# EAGLE design circle2 (EAGLE 7.6.0)
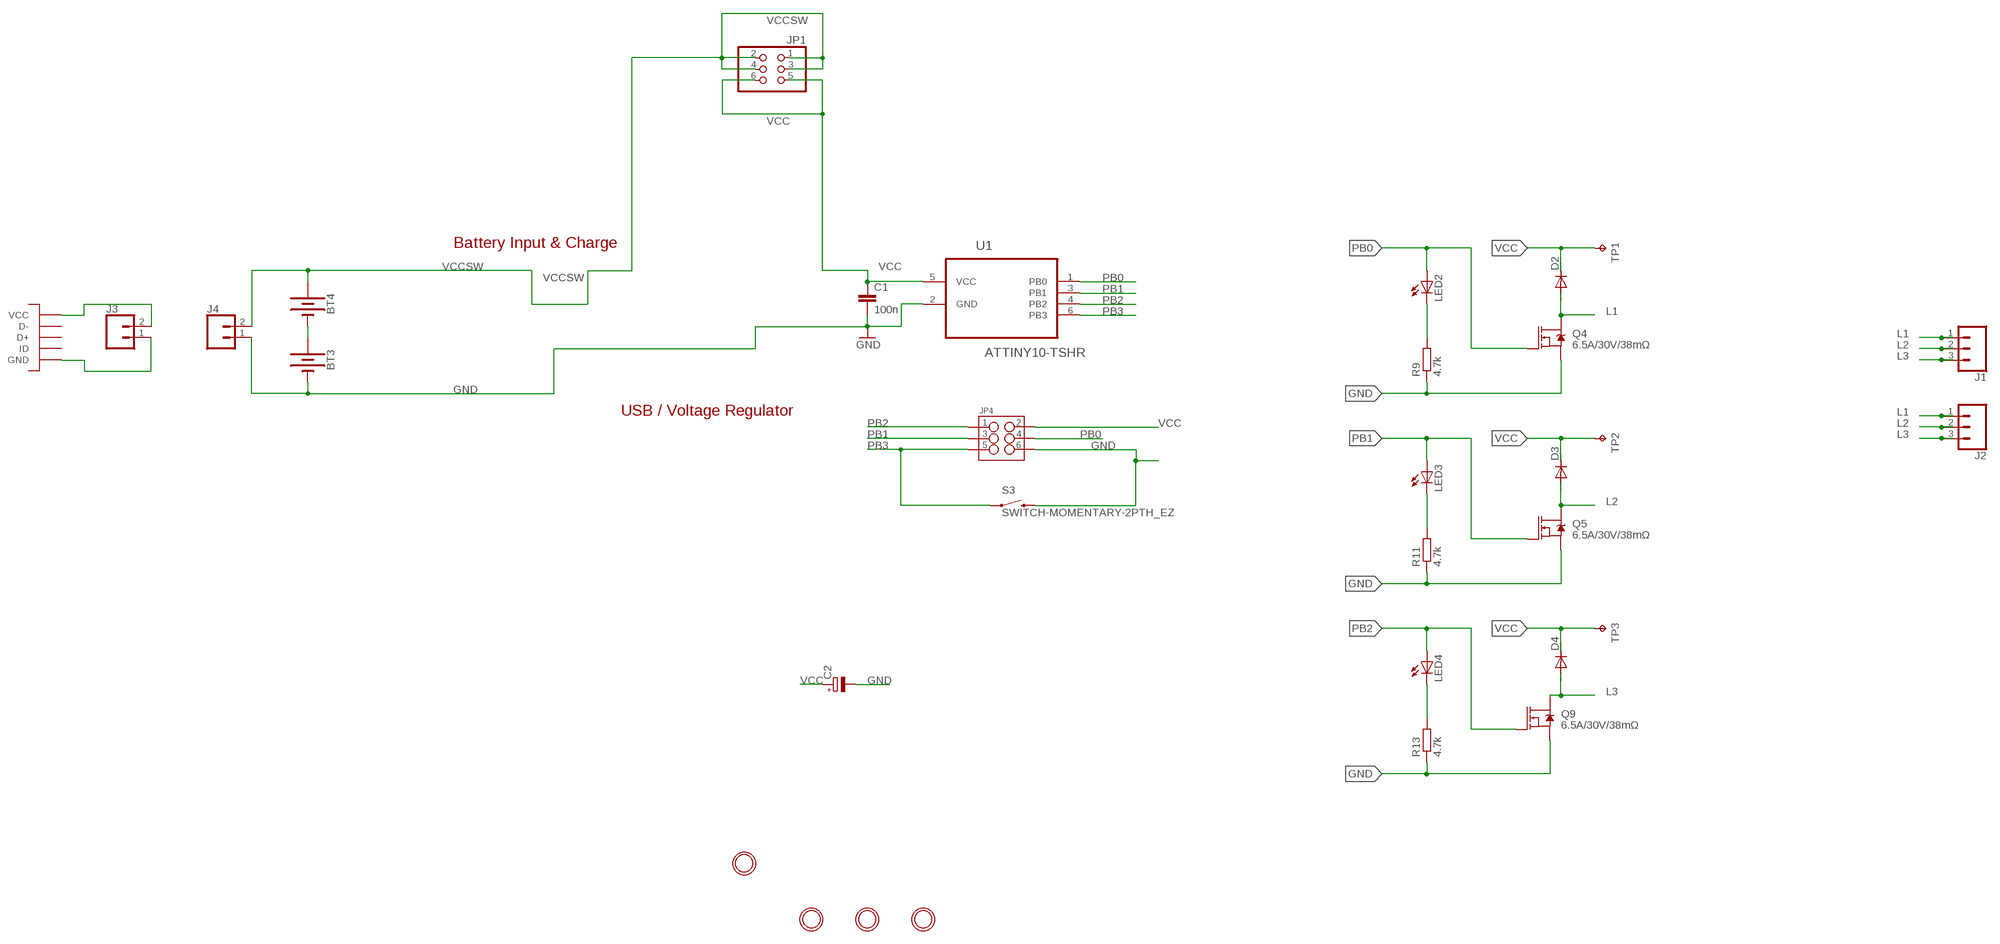
[diagram p0: schematic, sheet 1]

## Parts
BT3  BATTERY-AA_KIT  [BATTERY-AA-KIT]
BT4  BATTERY-AA_KIT  [BATTERY-AA-KIT]
C1  100n  CAP0805  [0805]
C2  CPOL-EUA  [PANASONIC_A]
D2  DIODE-DO214AC  [DO214AC]
D3  DIODE-DO214AC  [DO214AC]
D4  DIODE-DO214AC  [DO214AC]
J1  CONN_031X03_NO_SILK  [1X03_NO_SILK]
J2  CONN_031X03_NO_SILK  [1X03_NO_SILK]
J3  CONN_02LOCK_LONGPADS  [1X02_LOCK_LONGPADS]
J4  CONN_02LOCK_LONGPADS  [1X02_LOCK_LONGPADS]
JP1  PINHD-2X3  [2X03]
JP4  M03X2NO_SILK  [2X3-NS]
LED2  LEDKA-3528ASYC  [KA-3528ASYC]
LED3  LEDKA-3528ASYC  [KA-3528ASYC]
LED4  LEDKA-3528ASYC  [KA-3528ASYC]
Q4  6.5A/30V/38mΩ  MOSFET-NCH-FDS6630A  [SO08]
Q5  6.5A/30V/38mΩ  MOSFET-NCH-FDS6630A  [SO08]
Q9  6.5A/30V/38mΩ  MOSFET-NCH-FDS6630A  [SO08]
R9  4.7k  R-EU_R0603  [R0603]
R11  4.7k  R-EU_R0603  [R0603]
R13  4.7k  R-EU_R0603  [R0603]
S3  SWITCH-MOMENTARY-2PTH_EZ  [TACTILE-PTH-EZ]
TP1  TPTP20SQ  [TP20SQ]
TP2  TPTP20SQ  [TP20SQ]
TP3  TPTP20SQ  [TP20SQ]
U1  ATTINY10-TSHR  [SOT95P280X145-6N]
U$1  MOUNTINGHOLE2.0  [MOUNTINGHOLE_2.0_PLATED]
U$2  MOUNTINGHOLE2.0  [MOUNTINGHOLE_2.0_PLATED]
U$3  MOUNTINGHOLE2.0  [MOUNTINGHOLE_2.0_PLATED]
U$5  MICROUSB  [MICRO_B]
U$7  MOUNTINGHOLE2.0  [MOUNTINGHOLE_2.0_PLATED]

## Nets
GND [vcc]: BT3.GND@1(-) C1.2 C2.- J4.1 JP4.6 Q4.1(S) Q4.2(S) Q4.3(S) Q5.1(S) Q5.2(S) Q5.3(S) Q9.1(S) Q9.2(S) Q9.3(S) R9.1 R11.1 R13.1 S3.3 U1.2(GND)
GND1: J3.1 U$5.GND1(GND) U$5.GND2(GND) U$5.GND3(GND) U$5.GND4(GND) U$5.GND7(GND) U$5.GND8(GND) U$5.P5(GND)
L1: D2.A J1.1 J2.1 Q4.5(D) Q4.6(D) Q4.7(D) Q4.8(D)
L2: D3.A J1.2 J2.2 Q5.5(D) Q5.6(D) Q5.7(D) Q5.8(D)
L3: D4.A J1.3 J2.3 Q9.5(D) Q9.6(D) Q9.7(D) Q9.8(D)
N$1: BT3.PWR@1(+) BT4.GND@1(-)
N$34: LED2.C R9.2
N$36: LED3.C R11.2
N$38: LED4.C R13.2
PB0: JP4.4 LED2.A Q4.4(G) U1.1(PB0)
PB1: JP4.3 LED3.A Q5.4(G) U1.3(PB1)
PB2: JP4.1 LED4.A Q9.4(G) U1.4(PB2)
PB3: JP4.5 S3.1 U1.6(PB3)
VCC [vcc]: C1.1 C2.+ D2.C D3.C D4.C JP1.5 JP1.6 JP4.2 TP1.TP TP2.TP TP3.TP U1.5(VCC)
VCC1: J3.2 U$5.P1(VCC)
VCCSW [vcc]: BT4.PWR@1(+) J4.2 JP1.1 JP1.2 JP1.3 JP1.4
Unconnected: U$5.P2(D-) U$5.P3(D+) U$5.P4(ID)

## Notes on the sheet
- Battery Input & Charge
- USB / Voltage Regulator

## Library data of the parts
BT3 BT4 = SparkFun-Batteries:BATTERY: Battery - Single Cell A variety of battery chemistries, sizes, and footprints. Device List: 20MM_PTH - Coin Cell Battery Holder - 20mm (PTH) <https://www.sparkfun.com/products/783> 12MM_SMD - Coin Cell Battery Holder - 12mm (SMD) <https://www.sparkfun.com/products/10592> 12MM_PTH - Coin Cell Battery Holder - 12mm (PTH) <https://www.sparkfun.com/products/7948> 20MM_SMD - 20mm Coin Cell Battery Holder (SMD) (2 legs) Used on the Big Time Watch Kit <https://www.sparkfun.com/products/11734> 20MM_SMD_4LEGS - Coin Cell Battery Holder - 20mm (SMD) <https://www.sparkfun.com/products/11892> 20MM_SMD_4LEGS_OVERPASTE - Coin Cell Battery Holder - 20mm (SMD) <https://www.sparkfun.com/products/11892> (Over-paste on the legs) 24.5MM_PTH - Coin Cell Battery Holder - 24.5mm (PTH) <https://www.sparkfun.com/products/8863> 9V - 9V Battery Holder - PC Mount Used on the SparkFun SparkPunk Sound Kit <https://www.sparkfun.com/products/11177> and SparkFun SparkPunk Sequencer Kit <https://www.sparkfun.com/products/12707> 18650 - Battery Holder - 18650 (PTH) <https://www.sparkfun.com/products/13113> AA - Battery Holder - 1xAA (PTH) <https://www.sparkfun.com/products/7949> AAA - Battery Holder - 1xAAA (PTH) <https://www.sparkfun.com/products/12718> AA_KIT - Battery Holder - 1xAA (PTH) <https://www.sparkfun.com/products/7949> Special kit package - pads only have exposed copper on one side of the board. AAA_KIT - Battery Holder - 1xAAA (PTH) <https://www.sparkfun.com/products/12718> Special kit package - pads only have exposed copper on one side of the board.; PROD_ID: BATT-08316; SF_SKU: PRT-07949
C1 = SparkFun-Capacitors:CAP: Capacitor Standard 0603 ceramic capacitor, and 0.1" leaded capacitor.
C2 = rcl:CPOL-EU: POLARIZED CAPACITOR, European symbol
D2-D4 = diode:DIODE-: DIODE
J1 J2 = SparkFun-Connectors:CONN_03: Multi connection point. Often used as Generic Header-pin footprint for 0.1 inch spaced/style header connections On any of the 0.1 inch spaced packages, you can populate with these: Break Away Headers - Straight <https://www.sparkfun.com/products/116> (PRT-00116) Break Away Male Headers - Right Angle <https://www.sparkfun.com/products/553> (PRT-00553) Female Headers <https://www.sparkfun.com/products/115> (PRT-00115) Break Away Headers - Machine Pin <https://www.sparkfun.com/products/117> (PRT-00117) Break Away Female Headers - Swiss Machine Pin <https://www.sparkfun.com/products/743> (PRT-00743) Stackable Header - 3 Pin (Female, 0.1") <https://www.sparkfun.com/products/13875> (PRT-13875) For SCREWTERMINALS and SPRING TERMINALS visit here: Screw Terimnals on SparkFun.com <https://www.sparkfun.com/search/results?term=Screw+Terminals> (5mm/3.5mm/2.54mm spacing) This device is also useful as a general connection point to wire up your design to another part of your project. Our various solder wires solder well into these plated through hole pads. Hook-Up Wire - Assortment (Stranded, 22 AWG) <https://www.sparkfun.com/products/11375> (PRT-11375) Hook-Up Wire - Assortment (Solid Core, 22 AWG) <https://www.sparkfun.com/products/11367> (PRT-11367) View the entire wire category on our website here <https://www.sparkfun.com/categories/141> Special notes: Molex polarized connector foot print use with SKU : PRT-08232 with associated crimp pins and housings.
J3 J4 = SparkFun-Connectors:CONN_02: Multi connection point. Often used as Generic Header-pin footprint for 0.1 inch spaced/style header connections On any of the 0.1 inch spaced packages, you can populate with these: Break Away Headers - Straight <https://www.sparkfun.com/products/116> (PRT-00116) Break Away Male Headers - Right Angle <https://www.sparkfun.com/products/553> (PRT-00553) Female Headers <https://www.sparkfun.com/products/115> (PRT-00115) Break Away Headers - Machine Pin <https://www.sparkfun.com/products/117> (PRT-00117) Break Away Female Headers - Swiss Machine Pin <https://www.sparkfun.com/products/743> (PRT-00743) For SCREWTERMINALS and SPRING TERMINALS visit here: Screw Terimnals on SparkFun.com <https://www.sparkfun.com/search/results?term=Screw+Terminals> (5mm/3.5mm/2.54mm spacing) This device is also useful as a general connection point to wire up your design to another part of your project. Our various solder wires solder well into these plated through hole pads. Hook-Up Wire - Assortment (Stranded, 22 AWG) <https://www.sparkfun.com/products/11375> (PRT-11375) Hook-Up Wire - Assortment (Solid Core, 22 AWG) <https://www.sparkfun.com/products/11367> (PRT-11367) View the entire wire category on our website here <https://www.sparkfun.com/categories/141> Special notes: Molex polarized connector foot print use with: PRT-08233 with associated crimp pins and housings. 2.54_SCREWTERM for use with PRT-10571. 3.5mm Screw Terminal footprints for PRT-08084 5mm Screw Terminal footprints for use with PRT-08432
JP1 = pinhead:PINHD-2X3: PIN HEADER
JP4 = SparkFun-Connectors:M03X2: 2x3 .1" header. Shrouded, with keying- CONN-10681 SMT- CONN-11415 Pogo pins- HW-11044
LED2-LED4 = led:LED: LED OSRAM: - CHIPLED LG R971, LG N971, LY N971, LG Q971, LY Q971, LO R971, LY R971 LH N974, LH R974 LS Q976, LO Q976, LY Q976 LO Q996 - Hyper CHIPLED LW Q18S LB Q993, LB Q99A, LB R99A - SideLED LS A670, LO A670, LY A670, LG A670, LP A670 LB A673, LV A673, LT A673, LW A673 LH A674 LY A675 LS A676, LA A676, LO A676, LY A676, LW A676 LS A679, LY A679, LG A679 - Hyper Micro SIDELED® LS Y876, LA Y876, LO Y876, LY Y876 LT Y87S - SmartLED LW L88C, LW L88S LB L89C, LB L89S, LG L890 LS L89K, LO L89K, LY L89K LS L896, LA L896, LO L896, LY L896 - TOPLED LS T670, LO T670, LY T670, LG T670, LP T670 LSG T670, LSP T670, LSY T670, LOP T670, LYG T670 LG T671, LOG T671, LSG T671 LB T673, LV T673, LT T673, LW T673 LH T674 LS T676, LA T676, LO T676, LY T676, LB T676, LH T676, LSB T676, LW T676 LB T67C, LV T67C, LT T67C, LS T67K, LO T67K, LY T67K, LW E67C LS E67B, LA E67B, LO E67B, LY E67B, LB E67C, LV E67C, LT E67C LW T67C LS T679, LY T679, LG T679 LS T770, LO T770, LY T770, LG T770, LP T770 LB T773, LV T773, LT T773, LW T773 LH T774 LS E675, LA E675, LY E675, LS T675 LS T776, LA T776, LO T776, LY T776, LB T776 LHGB T686 LT T68C, LB T68C - Hyper Mini TOPLED® LB M676 - Mini TOPLED Santana® LG M470 LS M47K, LO M47K, LY M47K Source: http://www.osram.convergy.de LUXEON: - LUMILED® LXK2-PW12-R00, LXK2-PW12-S00, LXK2-PW14-U00, LXK2-PW14-V00 LXK2-PM12-R00, LXK2-PM12-S00, LXK2-PM14-U00 LXK2-PE12-Q00, LXK2-PE12-R00, LXK2-PE12-S00, LXK2-PE14-T00, LXK2-PE14-U00 LXK2-PB12-K00, LXK2-PB12-L00, LXK2-PB12-M00, LXK2-PB14-N00, LXK2-PB14-P00, LXK2-PB14-Q00 LXK2-PR12-L00, LXK2-PR12-M00, LXK2-PR14-Q00, LXK2-PR14-R00 LXK2-PD12-Q00, LXK2-PD12-R00, LXK2-PD12-S00 LXK2-PH12-R00, LXK2-PH12-S00 LXK2-PL12-P00, LXK2-PL12-Q00, LXK2-PL12-R00 Source: www.luxeon.com KINGBRIGHT: KA-3528ASYC Source: www.kingbright.com
Q4 Q5 Q9 = SparkFun-DiscreteSemi:MOSFET-NCH: N-channel MOSFETs Voltage controlled devices that allow control of high current outputs. SparkFun Products: SparkFun OpenScale <https://www.sparkfun.com/products/13261> SparkFun Digital Sandbox <https://www.sparkfun.com/products/12651> SparkFun Monster Moto Shield <https://www.sparkfun.com/products/10182> SparkFun MOSFET Power Controller <https://www.sparkfun.com/products/11214>; PROD_ID: TRANS-08089
R9 R11 R13 = rcl:R-EU_: RESISTOR, European symbol
S3 = SparkFun-Electromechanical:SWITCH-MOMENTARY-2: Various NO switches- pushbuttons, reed, etc
TP1-TP3 = testpad:TP: Test pad
U1 = Atmel_By_element14_Batch_1:ATTINY10-TSHR: 8-bit Microcontroller with In-System Programmable Flash; MPN: ATTINY10-TSHR; OC_FARNELL: 1748538; OC_NEWARK: 26R5645; PACKAGE: SOT-23-6; SUPPLIER: Atmel
U$1-U$3 U$7 = microbuilder:MOUNTINGHOLE: Mounting Hole For #2 screws (0.086"/2.18mm width, 0.094"/2.4mm hole) use 2.5mm; BOM: EXCLUDE
U$5 = Other:MICROUSB

## Net classes
0 default: width 0.406 mm, drill 0.381 mm, clearance 0.305 mm
1 vcc: width 0.508 mm, drill 0.381 mm, clearance 0.305 mm
2 gnd: width 0.508 mm, drill 0.381 mm, clearance 0.305 mm

## Board
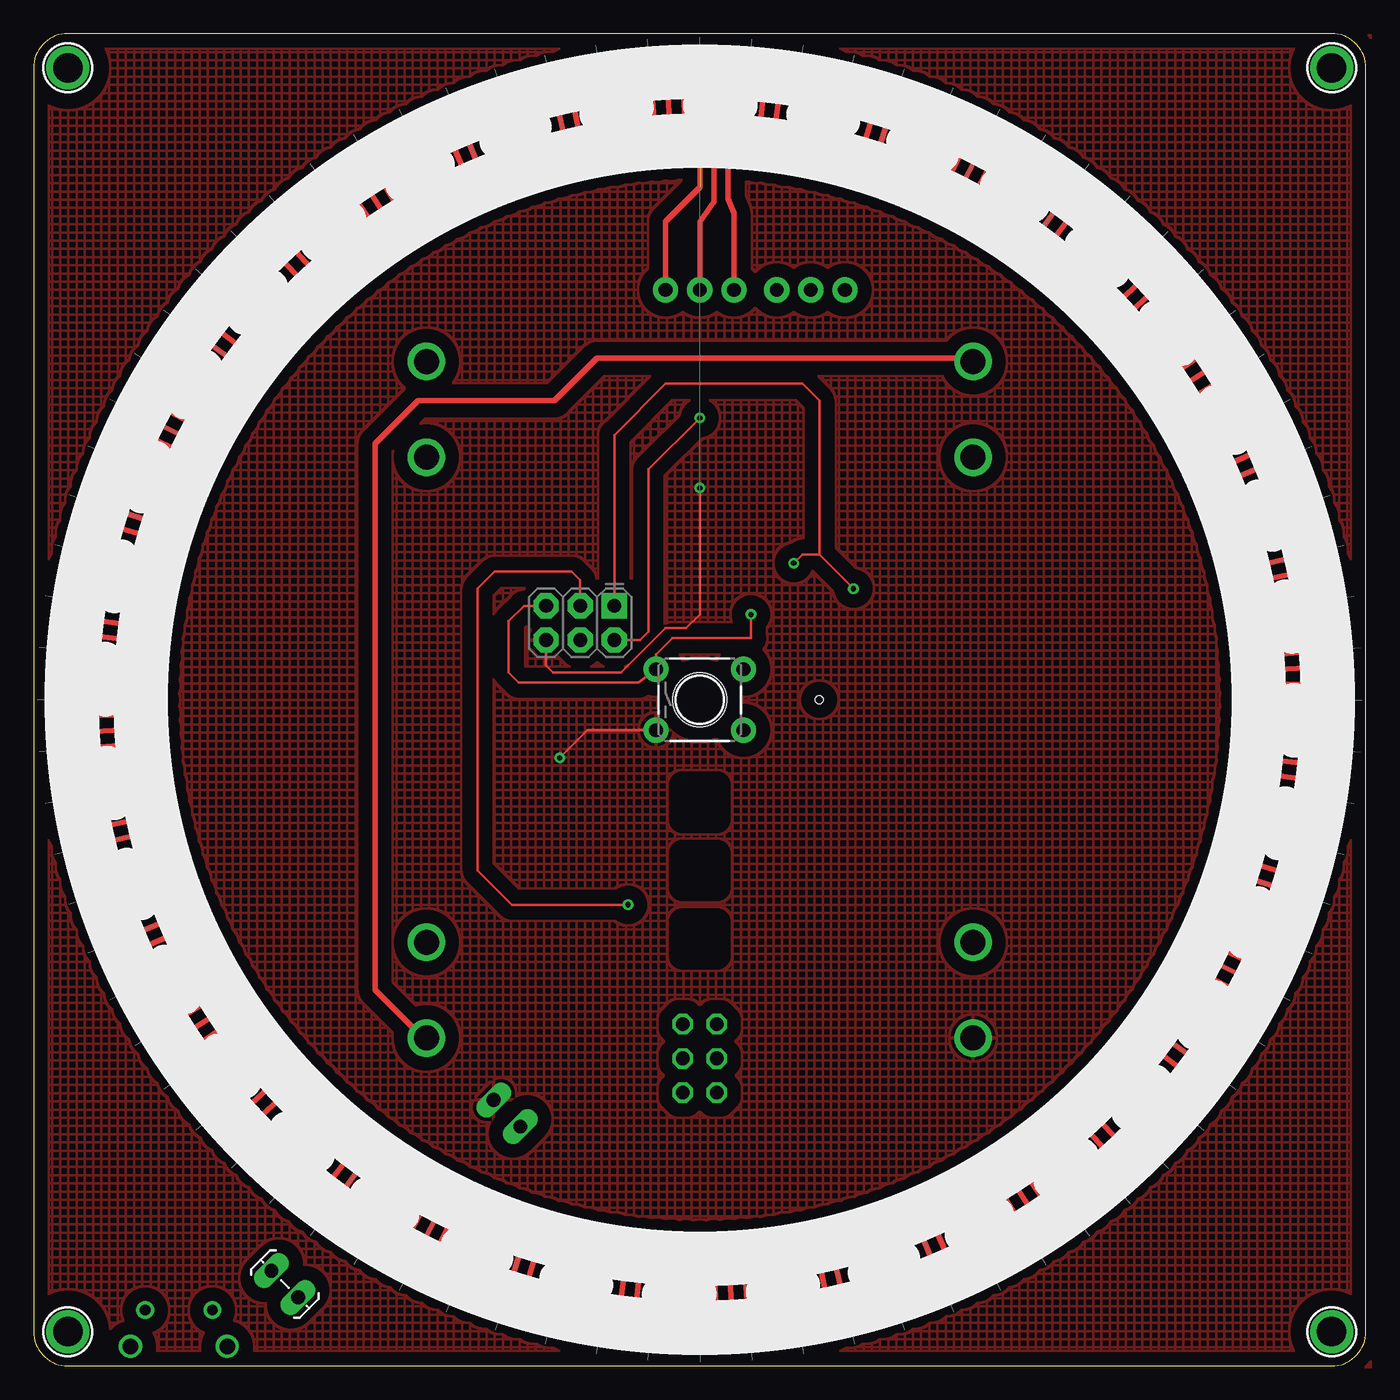
[diagram p1: board, top side]
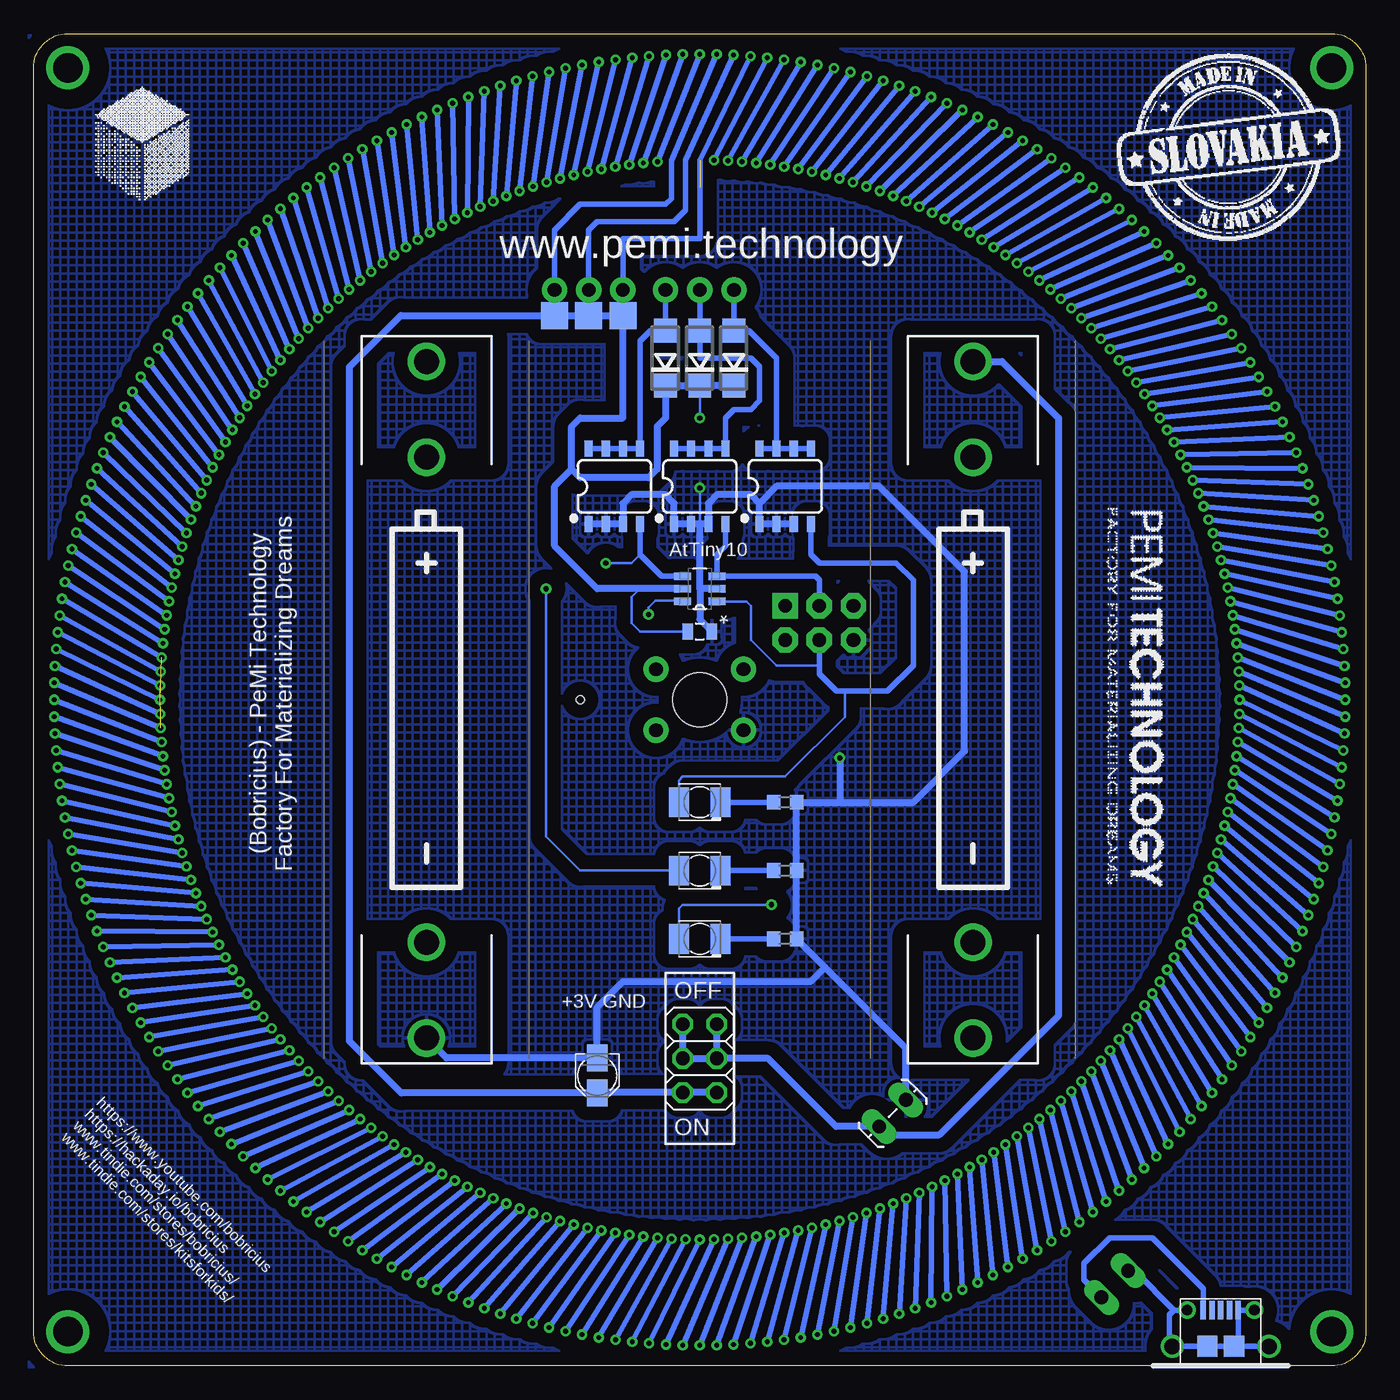
[diagram p2: board, bottom side, seen from below]

Size 99.06 x 99.06 mm. Coordinates in mm from the lower left corner, seen from the top.
Outline: 0,2.54 arc90 2.54,0 96.52,0 arc90 99.06,2.54 99.06,96.52 arc90 96.52,99.06 2.54,99.06 arc90 0,96.52 0,2.54
Copper layers (1*16): Top 0.035mm / dielectric 1.5mm / Bottom 0.035mm
Design rules "default *": minimum track width 10mil, minimum drill 24mil, track to track 8mil, track to pad 8mil, pad to pad 8mil, via to via 8mil, smd to smd 8mil, copper to edge 40mil, drill to drill 8mil, minimum pad ring 10mil, minimum via ring 8mil, stop-mask expansion 4mil, vias tented up to drill 30mil, thermal gap 10mil
Holes 4 mm at 49.53,49.53
Holes 0.6 mm at 58.42,49.53
tRestrict: area 48.3,30.5 to 50.8,33; area 48.3,40.6 to 50.8,43.2; area 48.3,35.6 to 50.8,38.1

### Footprints (pad centres in the part's own frame; a part is rotated, then mirrored left to right if it is on the bottom)
BATTERY-AA-KIT = drill 1.854: GND@1 25.146,0; GND@2 18.034,0; PWR@1 -25.146,0; PWR@2 -18.034,0
0805 = smd 0.8 x 1.2: 1 -0.9,0; 2 0.9,0
PANASONIC_A = smd 2 x 1.5: + 1.3,0; - -1.3,0
DO214AC = smd 1.8 x 1.7: A 2.05,0; C -2.05,0
1X03_NO_SILK = drill 1.016 pad 1.88: 1 0,0; 2 2.54,0; 3 5.08,0
1X02_LOCK_LONGPADS = drill 1.016 long: 1 -0.127,0; 2 2.667,0
2X03 = drill 1.016 octagon: 1 -2.54,-1.27; 2 -2.54,1.27; 3 0,-1.27; 4 0,1.27; 5 2.54,-1.27; 6 2.54,1.27
2X3-NS = drill 1.016 pad 1.88 square: 1 -2.54,-1.27 | drill 1.016 pad 1.88 octagon: 2 -2.54,1.27; 3 0,-1.27; 4 0,1.27; 5 2.54,-1.27; 6 2.54,1.27
KA-3528ASYC = smd 1.5 x 2.2: A -1.55,0; C 1.55,0
SO08 = smd 0.6 x 1.2: 1 -1.905,-2.8; 2 -0.635,-2.8; 3 0.635,-2.8; 4 1.905,-2.8; 5 1.905,2.8; 6 0.635,2.8; 7 -0.635,2.8; 8 -1.905,2.8
R0603 = smd 1 x 1.1: 1 -0.85,0; 2 0.85,0
TACTILE-PTH-EZ = drill 1.016 pad 1.88: 1 -3.251,2.261; 2 3.251,2.261; 3 -3.251,-2.261; 4 3.251,-2.261
TP20SQ = smd 2 x 2: TP 0,0
SOT95P280X145-6N = smd 1.27 x 0.559: 1 -1.295,0.94; 2 -1.295,0; 3 -1.295,-0.94; 4 1.295,-0.94; 5 1.295,0; 6 1.295,0.94
MOUNTINGHOLE_2.0_PLATED = drill 2.2 pad 3: P$1 0,0
MICRO_B = smd 1.5 x 1.55: GND1 -1,1.45; GND2 1,1.45 | drill 0.8: GND3 -2.5,4.15; GND4 2.5,4.15 | drill 1.15: GND7 -3.598,1.45; GND8 3.598,1.45 | smd 0.4 x 1.35: P1 -1.3,4.15; P2 -0.65,4.15; P3 0,4.15; P4 0.65,4.15; P5 1.3,4.15

### Placement (x,y rotation side)
BT3  69.85,49.53 270 bottom
BT4  29.21,49.53 270 bottom
C1  49.53,54.61 0 bottom
C2  57.15,21.59 270 bottom
D2  46.99,74.93 90 bottom
D3  49.53,74.93 90 bottom
D4  52.07,74.93 90 bottom
J1  46.99,80.01 0 top
J2  55.25,80.01 0 top
J3  17.78,6.98 315 top
J4  34.29,19.69 225 bottom
JP1  49.53,22.86 270 bottom
JP4  40.64,55.25 180 top
LED2  49.53,41.91 0 bottom
LED3  49.53,31.75 0 bottom
LED4  49.53,36.83 0 bottom
Q4  43.18,65.41 0 bottom
Q5  49.53,65.41 0 bottom
Q9  55.88,65.41 0 bottom
R9  43.18,41.91 180 bottom
R11  43.18,31.75 180 bottom
R13  43.18,36.83 180 bottom
S3  49.53,49.53 0 top
TP1  55.25,78.11 270 bottom
TP2  57.79,78.11 270 bottom
TP3  60.33,78.11 270 bottom
U1  49.53,57.79 180 bottom
U$1  96.52,2.54 270 top
U$2  2.54,2.54 270 top
U$3  96.52,96.52 270 top
U$5  10.8,0 0 bottom
U$7  2.54,96.52 270 top

### Tracks (layer width: path | path; a pad name or v marks a point on that pad's centre or on a via)
GND  (via drill 0.38, 0.38 pad 0.25)
  Top 0.203: S3.3 41.17,47.27 v39.12,45.21 | JP4.6 38.1,52.07 38.61,51.56 43.69,51.56 46.99,54.86 48.51,54.86 49.53,55.88 v49.53,65.28
  Bottom 0.203: v49.53,65.28 49.53,62.48
  Bottom 0.508: Q9.1 Q9.2 Q9.3 55.25,64.14 54.61,64.77 52.07,64.77 51.44,64.14 Q5.1 Q5.2 49.53,62.61 | 49.53,62.61 Q5.3 48.9,64.14 48.26,64.77 45.72,64.77 45.09,64.14 | Q4.3 Q4.2 Q4.1 45.09,64.14 | U1.2 49.53,57.79 | 49.53,57.79 49.53,62.48 49.53,62.61 | 49.53,57.79 49.53,55.51 C1.2 | J4.1 34.2,23.62 40.22,29.64 | 40.22,29.64 R11.1 R13.1 R9.1 39.12,41.91 | BT3.GND@1 68.36,22.89 C2.- 57.15,26.67 55.25,28.58 41.27,28.58 40.22,29.64 | 39.12,41.91 33.66,41.91 29.85,45.72 29.85,59.05 36.2,65.41 43.81,65.41 45.09,64.14 | v39.12,45.21 39.12,41.91
  pour Bottom (isolate 1.016, hatched): 0,99.06 99.44,98.93 99.44,-0.13 0,0
  pour Top (isolate 1.016, hatched): 0,99.06 0,0 99.44,-0.13 99.44,98.93
GND1
  Bottom 0.406: U$5.GND2 9.5,1.75 U$5.P5 U$5.GND4 | U$5.GND8 U$5.GND2 | U$5.GND2 U$5.GND1 U$5.GND7 14.61,1.66 14.61,3.81 14.27,4.15 | U$5.GND3 14.27,4.15 | J3.1 17.19,7.08 14.27,4.15
L1  (via drill 0.36)  (13 unrouted)
  Top 0.406: v49.53,97.54 49.53,87.63 46.99,85.09 J1.1 | v52.68,89.54 v53.3,97.39 | v55.81,89.17 v57.04,96.94 | v58.9,88.55 v60.74,96.21 | v61.93,87.7 v64.37,95.19 | v64.89,86.61 v67.9,93.88 | v67.75,85.29 v71.32,92.3 | v70.5,83.75 v74.61,90.46 | v73.12,82 v77.75,88.37 | v75.59,80.05 v80.71,86.03 | v77.91,77.91 v83.47,83.47 | v80.05,75.59 v86.03,80.71 | v82,73.12 v88.37,77.75 | v83.75,70.5 v90.46,74.61 | v85.29,67.75 v92.3,71.32 | v86.61,64.89 v93.88,67.9 | v87.7,61.93 v95.19,64.37 | v88.55,58.9 v96.21,60.74 | v89.17,55.81 v96.94,57.04 | v89.66,49.53 v97.54,49.53 | v89.54,46.38 v97.39,45.76 | v46.38,89.54 v45.76,97.39
  Bottom 0.406: v49.53,97.54 v52.68,89.54 | v53.3,97.39 v55.81,89.17 | v57.04,96.94 v58.9,88.55 | v60.74,96.21 v61.93,87.7 | v64.37,95.19 v64.89,86.61 | v67.9,93.88 v67.75,85.29 | v71.32,92.3 v70.5,83.75 | v74.61,90.46 v73.12,82 | v77.75,88.37 v75.59,80.05 | v80.71,86.03 v77.91,77.91 | v83.47,83.47 v80.05,75.59 | v86.03,80.71 v82,73.12 | v88.37,77.75 v83.75,70.5 | v90.46,74.61 v85.29,67.75 | v92.3,71.32 v86.61,64.89 | v93.88,67.9 v87.7,61.93 | v95.19,64.37 v88.55,58.9 | v96.21,60.74 v89.17,55.81 | v96.94,57.04 89.54,52.68 | v97.54,49.53 v89.54,46.38 | v97.39,45.76 89.17,43.25 | v45.76,97.39 49.53,89.66 49.53,83.82 55.25,83.82 J2.1 | J1.1 D2.A 45.87,76.98 43.81,74.93 Q4.7 | Q4.8 Q4.7 | Q4.7 Q4.6 Q4.5
L2  (via drill 0.36)  (18 unrouted)
  Top 0.406: v50.79,97.52 50.58,89.65 50.58,86.58 49.53,85.09 J1.2 | v53.73,89.44 v54.55,97.27 | v56.84,88.99 v58.28,96.73 | v59.92,88.3 v61.95,95.9 | v62.93,87.36 v65.56,94.78 | v65.85,86.19 v69.06,93.39 | v68.68,84.8 v72.44,91.72 | v71.39,83.19 v75.68,89.79 | v73.96,81.37 v78.75,87.62 | v76.38,79.35 v81.65,85.2 | v78.64,77.16 v84.35,82.58 | v80.72,74.79 v86.84,79.74 | v82.6,72.26 v89.09,76.72 | v84.28,69.6 v91.1,73.53 | v85.75,66.81 v92.86,70.2 | v87,63.91 v94.35,66.73 | v88.01,60.93 v95.56,63.16 | v88.78,57.87 v96.49,59.51 | v89.32,54.77 v97.12,55.8 | v89.61,51.63 v97.47,52.04 | v89.65,48.48 v97.52,48.27 | v89.44,45.34 v97.27,44.51 | v47.43,89.61 v47.02,97.47
  Bottom 0.406: v50.79,97.52 v53.73,89.44 | v54.55,97.27 v56.84,88.99 | v58.28,96.73 v59.92,88.3 | v61.95,95.9 v62.93,87.36 | v65.56,94.78 v65.85,86.19 | v69.06,93.39 v68.68,84.8 | v72.44,91.72 v71.39,83.19 | v75.68,89.79 v73.96,81.37 | v78.75,87.62 v76.38,79.35 | v81.65,85.2 v78.64,77.16 | v84.35,82.58 v80.72,74.79 | v86.84,79.74 v82.6,72.26 | v89.09,76.72 v84.28,69.6 | v91.1,73.53 v85.75,66.81 | v92.86,70.2 v87,63.91 | v94.35,66.73 v88.01,60.93 | v95.56,63.16 v88.78,57.87 | v96.49,59.51 v89.32,54.77 | v97.12,55.8 v89.61,51.63 | v97.47,52.04 v89.65,48.48 | v97.52,48.27 v89.44,45.34 | v97.27,44.51 88.99,42.22 | v47.02,97.47 50.58,89.65 50.58,85.94 51.44,85.09 57.15,85.09 57.79,84.45 J2.2 | J1.2 D3.A 49.53,74.93 45.72,74.93 45.09,74.3 45.09,71.75 45.72,71.12 46.99,71.12 47.62,70.48 Q5.5 Q5.6 Q5.7 Q5.8
L3  (via drill 0.36)  (19 unrouted)
  Top 0.406: v52.04,97.47 51.63,89.61 51.63,86.8 52.07,85.72 J1.3 | v54.77,89.32 v55.8,97.12 | v57.87,88.78 v59.51,96.49 | v60.93,88.01 v63.16,95.56 | v63.91,87 v66.73,94.35 | v66.81,85.75 v70.2,92.86 | v69.6,84.28 v73.53,91.1 | v72.26,82.6 v76.72,89.09 | v74.79,80.72 v79.74,86.84 | v77.16,78.64 v82.58,84.35 | v79.35,76.38 v85.2,81.65 | v81.37,73.96 v87.62,78.75 | v83.19,71.39 v89.79,75.68 | v84.8,68.68 v91.72,72.44 | v86.19,65.85 v93.39,69.06 | v87.36,62.93 v94.78,65.56 | v88.3,59.92 v95.9,61.95 | v88.99,56.84 v96.73,58.28 | v89.44,53.73 v97.27,54.55 | v89.61,47.43 v97.47,47.02 | v48.48,89.65 v48.27,97.52
  Bottom 0.406: v52.04,97.47 v54.77,89.32 | v55.8,97.12 v57.87,88.78 | v59.51,96.49 v60.93,88.01 | v63.16,95.56 v63.91,87 | v66.73,94.35 v66.81,85.75 | v70.2,92.86 v69.6,84.28 | v73.53,91.1 v72.26,82.6 | v76.72,89.09 v74.79,80.72 | v79.74,86.84 v77.16,78.64 | v82.58,84.35 v79.35,76.38 | v85.2,81.65 v81.37,73.96 | v87.62,78.75 v83.19,71.39 | v89.79,75.68 v84.8,68.68 | v91.72,72.44 v86.19,65.85 | v93.39,69.06 v87.36,62.93 | v94.78,65.56 v88.3,59.92 | v95.9,61.95 v88.99,56.84 | v96.73,58.28 v89.44,53.73 | v97.27,54.55 89.65,50.58 | v97.47,47.02 89.32,44.29 | v48.27,97.52 51.63,89.61 51.63,86.8 52.07,86.36 58.42,86.36 60.33,84.45 J2.3 | J1.3 D4.A 53.2,76.98 53.98,76.2 Q9.5 Q9.6 Q9.7 Q9.8
L10  (via drill 0.36)
  Top 0.406: v43.25,89.17 v42.02,96.94
  Bottom 0.406: v42.02,96.94 46.38,89.54
L11  (via drill 0.36)
  Top 0.406: v45.34,89.44 v44.51,97.27
  Bottom 0.406: v44.51,97.27 48.48,89.65
L12  (via drill 0.36)
  Top 0.406: v44.29,89.32 v43.26,97.12
  Bottom 0.406: v43.26,97.12 47.43,89.61
L13  (via drill 0.36)
  Top 0.406: v40.16,88.55 v38.32,96.21
  Bottom 0.406: v38.32,96.21 43.25,89.17
L14  (via drill 0.36)
  Top 0.406: v42.22,88.99 v40.78,96.73
  Bottom 0.406: v40.78,96.73 45.34,89.44
L15  (via drill 0.36)
  Top 0.406: v41.19,88.78 v39.55,96.49
  Bottom 0.406: v39.55,96.49 44.29,89.32
L16  (via drill 0.36)
  Top 0.406: v37.13,87.7 v34.7,95.19
  Bottom 0.406: v34.7,95.19 40.16,88.55
L17  (via drill 0.36)
  Top 0.406: v39.14,88.3 v37.11,95.9
  Bottom 0.406: v37.11,95.9 42.22,88.99
L18  (via drill 0.36)
  Top 0.406: v38.13,88.01 v35.9,95.56
  Bottom 0.406: v35.9,95.56 41.19,88.78
L19  (via drill 0.36)
  Top 0.406: v34.17,86.61 v31.16,93.88
  Bottom 0.406: v31.16,93.88 37.13,87.7
L20  (via drill 0.36)
  Top 0.406: v36.13,87.36 v33.51,94.78
  Bottom 0.406: v33.51,94.78 39.14,88.3
L21  (via drill 0.36)
  Top 0.406: v35.15,87 v32.33,94.35
  Bottom 0.406: v32.33,94.35 38.13,88.01
L22  (via drill 0.36)
  Top 0.406: v31.31,85.29 v27.74,92.3
  Bottom 0.406: v27.74,92.3 34.17,86.61
L23  (via drill 0.36)
  Top 0.406: v33.21,86.19 v30,93.39
  Bottom 0.406: v30,93.39 36.13,87.36
L24  (via drill 0.36)
  Top 0.406: v32.25,85.75 v28.86,92.86
  Bottom 0.406: v28.86,92.86 35.15,87
L25  (via drill 0.36)
  Top 0.406: v28.56,83.75 v24.45,90.46
  Bottom 0.406: v24.45,90.46 31.31,85.29
L26  (via drill 0.36)
  Top 0.406: v30.38,84.8 v26.62,91.72
  Bottom 0.406: v26.62,91.72 33.21,86.19
L27  (via drill 0.36)
  Top 0.406: v29.46,84.28 v25.53,91.1
  Bottom 0.406: v25.53,91.1 32.25,85.75
L28  (via drill 0.36)
  Top 0.406: v25.94,82 v21.31,88.37
  Bottom 0.406: v21.31,88.37 28.56,83.75
L29  (via drill 0.36)
  Top 0.406: v27.67,83.19 v23.38,89.79
  Bottom 0.406: v23.38,89.79 30.38,84.8
L30  (via drill 0.36)
  Top 0.406: v26.8,82.6 v22.34,89.09
  Bottom 0.406: v22.34,89.09 29.46,84.28
L31  (via drill 0.36)
  Top 0.406: v23.47,80.05 v18.35,86.03
  Bottom 0.406: v18.35,86.03 25.94,82
L32  (via drill 0.36)
  Top 0.406: v25.1,81.37 v20.31,87.62
  Bottom 0.406: v20.31,87.62 27.67,83.19
L33  (via drill 0.36)
  Top 0.406: v24.27,80.72 v19.32,86.84
  Bottom 0.406: v19.32,86.84 26.8,82.6
L34  (via drill 0.36)
  Top 0.406: v21.15,77.91 v15.59,83.47
  Bottom 0.406: v15.59,83.47 23.47,80.05
L35  (via drill 0.36)
  Top 0.406: v22.68,79.35 v17.41,85.2
  Bottom 0.406: v17.41,85.2 25.1,81.37
L36  (via drill 0.36)
  Top 0.406: v21.91,78.64 v16.48,84.35
  Bottom 0.406: v16.48,84.35 24.27,80.72
L37  (via drill 0.36)
  Top 0.406: v19.01,75.59 v13.03,80.71
  Bottom 0.406: v13.03,80.71 21.15,77.91
L38  (via drill 0.36)
  Top 0.406: v20.42,77.16 v14.71,82.58
  Bottom 0.406: v14.71,82.58 22.68,79.35
L39  (via drill 0.36)
  Top 0.406: v19.71,76.38 v13.86,81.65
  Bottom 0.406: v13.86,81.65 21.91,78.64
L40  (via drill 0.36)
  Top 0.406: v17.06,73.12 v10.69,77.75
  Bottom 0.406: v10.69,77.75 19.01,75.59
L41  (via drill 0.36)
  Top 0.406: v18.34,74.79 v12.22,79.74
  Bottom 0.406: v12.22,79.74 20.42,77.16
L42  (via drill 0.36)
  Top 0.406: v17.69,73.96 v11.44,78.75
  Bottom 0.406: v11.44,78.75 19.71,76.38
L43  (via drill 0.36)
  Top 0.406: v15.31,70.5 v8.6,74.61
  Bottom 0.406: v8.6,74.61 17.06,73.12
L44  (via drill 0.36)
  Top 0.406: v16.46,72.26 v9.97,76.72
  Bottom 0.406: v9.97,76.72 18.34,74.79
L45  (via drill 0.36)
  Top 0.406: v15.87,71.39 v9.27,75.68
  Bottom 0.406: v9.27,75.68 17.69,73.96
L46  (via drill 0.36)
  Top 0.406: v13.77,67.75 v6.76,71.32
  Bottom 0.406: v6.76,71.32 15.31,70.5
L47  (via drill 0.36)
  Top 0.406: v14.77,69.6 v7.96,73.53
  Bottom 0.406: v7.96,73.53 16.46,72.26
L48  (via drill 0.36)
  Top 0.406: v14.26,68.68 v7.34,72.44
  Bottom 0.406: v7.34,72.44 15.87,71.39
L49  (via drill 0.36)
  Top 0.406: v12.45,64.89 v5.18,67.9
  Bottom 0.406: v5.18,67.9 13.77,67.75
L50  (via drill 0.36)
  Top 0.406: v13.31,66.81 v6.2,70.2
  Bottom 0.406: v6.2,70.2 14.77,69.6
L51  (via drill 0.36)
  Top 0.406: v12.87,65.85 v5.67,69.06
  Bottom 0.406: v5.67,69.06 14.26,68.68
L52  (via drill 0.36)
  Top 0.406: v11.36,61.93 v3.87,64.37
  Bottom 0.406: v3.87,64.37 12.45,64.89
L53  (via drill 0.36)
  Top 0.406: v12.06,63.91 v4.71,66.73
  Bottom 0.406: v4.71,66.73 13.31,66.81
L54  (via drill 0.36)
  Top 0.406: v11.7,62.93 v4.28,65.56
  Bottom 0.406: v4.28,65.56 12.87,65.85
L55  (via drill 0.36)
  Top 0.406: v10.51,58.9 v2.85,60.74
  Bottom 0.406: v2.85,60.74 11.36,61.93
L56  (via drill 0.36)
  Top 0.406: v11.05,60.93 v3.5,63.16
  Bottom 0.406: v3.5,63.16 12.06,63.91
L57  (via drill 0.36)
  Top 0.406: v10.77,59.92 v3.16,61.95
  Bottom 0.406: v3.16,61.95 11.7,62.93
L58  (via drill 0.36)
  Top 0.406: v9.89,55.81 v2.12,57.04
  Bottom 0.406: v2.12,57.04 10.51,58.9
L59  (via drill 0.36)
  Top 0.406: v10.27,57.87 v2.57,59.51
  Bottom 0.406: v2.57,59.51 11.05,60.93
L60  (via drill 0.36)
  Top 0.406: v10.07,56.84 v2.33,58.28
  Bottom 0.406: v2.33,58.28 10.77,59.92
L61  (via drill 0.36)
  Top 0.406: v9.52,52.68 v1.67,53.3
  Bottom 0.406: v1.67,53.3 9.89,55.81
L62  (via drill 0.36)
  Top 0.406: v9.74,54.77 v1.94,55.8
  Bottom 0.406: v1.94,55.8 10.27,57.87
L63  (via drill 0.36)
  Top 0.406: v9.62,53.73 v1.79,54.55
  Bottom 0.406: v1.79,54.55 10.07,56.84
L64  (via drill 0.36)
  Top 0.406: v9.4,49.53 v1.52,49.53
  Bottom 0.406: v1.52,49.53 9.52,52.68
L65  (via drill 0.36)
  Top 0.406: v9.45,51.63 v1.59,52.04
  Bottom 0.406: v1.59,52.04 9.74,54.77
L66  (via drill 0.36)
  Top 0.406: v9.41,50.58 v1.54,50.79
  Bottom 0.406: v1.54,50.79 9.62,53.73
L67  (via drill 0.36)
  Top 0.406: v9.52,46.38 v1.67,45.76
  Bottom 0.406: v1.67,45.76 9.4,49.53
L68  (via drill 0.36)
  Top 0.406: v9.41,48.48 v1.54,48.27
  Bottom 0.406: v1.54,48.27 9.45,51.63
L69  (via drill 0.36)
  Top 0.406: v9.45,47.43 v1.59,47.02
  Bottom 0.406: v1.59,47.02 9.41,50.58
L70  (via drill 0.36)
  Top 0.406: v9.89,43.25 v2.12,42.02
  Bottom 0.406: v2.12,42.02 9.52,46.38
L71  (via drill 0.36)
  Top 0.406: v9.62,45.34 v1.79,44.51
  Bottom 0.406: v1.79,44.51 9.41,48.48
L72  (via drill 0.36)
  Top 0.406: v9.74,44.29 v1.94,43.26
  Bottom 0.406: v1.94,43.26 9.45,47.43
L73  (via drill 0.36)
  Top 0.406: v10.51,40.16 v2.85,38.32
  Bottom 0.406: v2.85,38.32 9.89,43.25
L74  (via drill 0.36)
  Top 0.406: v10.07,42.22 v2.33,40.78
  Bottom 0.406: v2.33,40.78 9.62,45.34
L75  (via drill 0.36)
  Top 0.406: v10.27,41.19 v2.57,39.55
  Bottom 0.406: v2.57,39.55 9.74,44.29
L76  (via drill 0.36)
  Top 0.406: v11.36,37.13 v3.87,34.7
  Bottom 0.406: v3.87,34.7 10.51,40.16
L77  (via drill 0.36)
  Top 0.406: v10.77,39.14 v3.16,37.11
  Bottom 0.406: v3.16,37.11 10.07,42.22
L78  (via drill 0.36)
  Top 0.406: v11.05,38.13 v3.5,35.9
  Bottom 0.406: v3.5,35.9 10.27,41.19
L79  (via drill 0.36)
  Top 0.406: v12.45,34.17 v5.18,31.16
  Bottom 0.406: v5.18,31.16 11.36,37.13
L80  (via drill 0.36)
  Top 0.406: v11.7,36.13 v4.28,33.51
  Bottom 0.406: v4.28,33.51 10.77,39.14
L81  (via drill 0.36)
  Top 0.406: v12.06,35.15 v4.71,32.33
  Bottom 0.406: v4.71,32.33 11.05,38.13
L82  (via drill 0.36)
  Top 0.406: v13.77,31.31 v6.76,27.74
  Bottom 0.406: v6.76,27.74 12.45,34.17
L83  (via drill 0.36)
  Top 0.406: v12.87,33.21 v5.67,30
  Bottom 0.406: v5.67,30 11.7,36.13
L84  (via drill 0.36)
  Top 0.406: v13.31,32.25 v6.2,28.86
  Bottom 0.406: v6.2,28.86 12.06,35.15
L85  (via drill 0.36)
  Top 0.406: v15.31,28.56 v8.6,24.45
  Bottom 0.406: v8.6,24.45 13.77,31.31
L86  (via drill 0.36)
  Top 0.406: v14.26,30.38 v7.34,26.62
  Bottom 0.406: v7.34,26.62 12.87,33.21
L87  (via drill 0.36)
  Top 0.406: v14.77,29.46 v7.96,25.53
  Bottom 0.406: v7.96,25.53 13.31,32.25
L88  (via drill 0.36)
  Top 0.406: v17.06,25.94 v10.69,21.31
  Bottom 0.406: v10.69,21.31 15.31,28.56
L89  (via drill 0.36)
  Top 0.406: v15.87,27.67 v9.27,23.38
  Bottom 0.406: v9.27,23.38 14.26,30.38
L90  (via drill 0.36)
  Top 0.406: v16.46,26.8 v9.97,22.34
  Bottom 0.406: v9.97,22.34 14.77,29.46
L91  (via drill 0.36)
  Top 0.406: v19.01,23.47 v13.03,18.35
  Bottom 0.406: v13.03,18.35 17.06,25.94
L92  (via drill 0.36)
  Top 0.406: v17.69,25.1 v11.44,20.31
  Bottom 0.406: v11.44,20.31 15.87,27.67
L93  (via drill 0.36)
  Top 0.406: v18.34,24.27 v12.22,19.32
  Bottom 0.406: v12.22,19.32 16.46,26.8
L94  (via drill 0.36)
  Top 0.406: v21.15,21.15 v15.59,15.59
  Bottom 0.406: v15.59,15.59 19.01,23.47
L95  (via drill 0.36)
  Top 0.406: v19.71,22.68 v13.86,17.41
  Bottom 0.406: v13.86,17.41 17.69,25.1
L96  (via drill 0.36)
  Top 0.406: v20.42,21.91 v14.71,16.48
  Bottom 0.406: v14.71,16.48 18.34,24.27
L97  (via drill 0.36)
  Top 0.406: v23.47,19.01 v18.35,13.03
  Bottom 0.406: v18.35,13.03 21.15,21.15
L98  (via drill 0.36)
  Top 0.406: v21.91,20.42 v16.48,14.71
  Bottom 0.406: v16.48,14.71 19.71,22.68
L99  (via drill 0.36)
  Top 0.406: v22.68,19.71 v17.41,13.86
  Bottom 0.406: v17.41,13.86 20.42,21.91
L100  (via drill 0.36)
  Top 0.406: v25.94,17.06 v21.31,10.69
  Bottom 0.406: v21.31,10.69 23.47,19.01
L101  (via drill 0.36)
  Top 0.406: v24.27,18.34 v19.32,12.22
  Bottom 0.406: v19.32,12.22 21.91,20.42
L102  (via drill 0.36)
  Top 0.406: v25.1,17.69 v20.31,11.44
  Bottom 0.406: v20.31,11.44 22.68,19.71
L103  (via drill 0.36)
  Top 0.406: v28.56,15.31 v24.45,8.6
  Bottom 0.406: v24.45,8.6 25.94,17.06
L104  (via drill 0.36)
  Top 0.406: v26.8,16.46 v22.34,9.97
  Bottom 0.406: v22.34,9.97 24.27,18.34
L105  (via drill 0.36)
  Top 0.406: v27.67,15.87 v23.38,9.27
  Bottom 0.406: v23.38,9.27 25.1,17.69
L106  (via drill 0.36)
  Top 0.406: v31.31,13.77 v27.74,6.76
  Bottom 0.406: v27.74,6.76 28.56,15.31
L107  (via drill 0.36)
  Top 0.406: v29.46,14.77 v25.53,7.96
  Bottom 0.406: v25.53,7.96 26.8,16.46
L108  (via drill 0.36)
  Top 0.406: v30.38,14.26 v26.62,7.34
  Bottom 0.406: v26.62,7.34 27.67,15.87
L109  (via drill 0.36)
  Top 0.406: v34.17,12.45 v31.16,5.18
  Bottom 0.406: v31.16,5.18 31.31,13.77
L110  (via drill 0.36)
  Top 0.406: v32.25,13.31 v28.86,6.2
  Bottom 0.406: v28.86,6.2 29.46,14.77
L111  (via drill 0.36)
  Top 0.406: v33.21,12.87 v30,5.67
  Bottom 0.406: v30,5.67 30.38,14.26
L112  (via drill 0.36)
  Top 0.406: v37.13,11.36 v34.7,3.87
  Bottom 0.406: v34.7,3.87 34.17,12.45
L113  (via drill 0.36)
  Top 0.406: v35.15,12.06 v32.33,4.71
  Bottom 0.406: v32.33,4.71 32.25,13.31
L114  (via drill 0.36)
  Top 0.406: v36.13,11.7 v33.51,4.28
  Bottom 0.406: v33.51,4.28 33.21,12.87
L115  (via drill 0.36)
  Top 0.406: v40.16,10.51 v38.32,2.85
  Bottom 0.406: v38.32,2.85 37.13,11.36
L116  (via drill 0.36)
  Top 0.406: v38.13,11.05 v35.9,3.5
  Bottom 0.406: v35.9,3.5 35.15,12.06
L117  (via drill 0.36)
  Top 0.406: v39.14,10.77 v37.11,3.16
  Bottom 0.406: v37.11,3.16 36.13,11.7
L118  (via drill 0.36)
  Top 0.406: v43.25,9.89 v42.02,2.12
  Bottom 0.406: v42.02,2.12 40.16,10.51
L119  (via drill 0.36)
  Top 0.406: v41.19,10.27 v39.55,2.57
  Bottom 0.406: v39.55,2.57 38.13,11.05
L120  (via drill 0.36)
  Top 0.406: v42.22,10.07 v40.78,2.33
  Bottom 0.406: v40.78,2.33 39.14,10.77
L121  (via drill 0.36)
  Top 0.406: v46.38,9.52 v45.76,1.67
  Bottom 0.406: v45.76,1.67 43.25,9.89
L122  (via drill 0.36)
  Top 0.406: v44.29,9.74 v43.26,1.94
  Bottom 0.406: v43.26,1.94 41.19,10.27
L123  (via drill 0.36)
  Top 0.406: v45.34,9.62 v44.51,1.79
  Bottom 0.406: v44.51,1.79 42.22,10.07
L124  (via drill 0.36)
  Top 0.406: v49.53,9.4 v49.53,1.52
  Bottom 0.406: v49.53,1.52 46.38,9.52
L125  (via drill 0.36)
  Top 0.406: v47.43,9.45 v47.02,1.59
  Bottom 0.406: v47.02,1.59 44.29,9.74
L126  (via drill 0.36)
  Top 0.406: v48.48,9.41 v48.27,1.54
  Bottom 0.406: v48.27,1.54 45.34,9.62
L127  (via drill 0.36)
  Top 0.406: v52.68,9.52 v53.3,1.67
  Bottom 0.406: v53.3,1.67 49.53,9.4
L128  (via drill 0.36)
  Top 0.406: v50.58,9.41 v50.79,1.54
  Bottom 0.406: v50.79,1.54 47.43,9.45
L129  (via drill 0.36)
  Top 0.406: v51.63,9.45 v52.04,1.59
  Bottom 0.406: v52.04,1.59 48.48,9.41
L130  (via drill 0.36)
  Top 0.406: v55.81,9.89 v57.04,2.12
  Bottom 0.406: v57.04,2.12 52.68,9.52
L131  (via drill 0.36)
  Top 0.406: v53.73,9.62 v54.55,1.79
  Bottom 0.406: v54.55,1.79 50.58,9.41
L132  (via drill 0.36)
  Top 0.406: v54.77,9.74 v55.8,1.94
  Bottom 0.406: v55.8,1.94 51.63,9.45
L133  (via drill 0.36)
  Top 0.406: v58.9,10.51 v60.74,2.85
  Bottom 0.406: v60.74,2.85 55.81,9.89
L134  (via drill 0.36)
  Top 0.406: v56.84,10.07 v58.28,2.33
  Bottom 0.406: v58.28,2.33 53.73,9.62
L135  (via drill 0.36)
  Top 0.406: v57.87,10.27 v59.51,2.57
  Bottom 0.406: v59.51,2.57 54.77,9.74
L136  (via drill 0.36)
  Top 0.406: v61.93,11.36 v64.37,3.87
  Bottom 0.406: v64.37,3.87 58.9,10.51
L137  (via drill 0.36)
  Top 0.406: v59.92,10.77 v61.95,3.16
  Bottom 0.406: v61.95,3.16 56.84,10.07
L138  (via drill 0.36)
  Top 0.406: v60.93,11.05 v63.16,3.5
  Bottom 0.406: v63.16,3.5 57.87,10.27
L139  (via drill 0.36)
  Top 0.406: v64.89,12.45 v67.9,5.18
  Bottom 0.406: v67.9,5.18 61.93,11.36
L140  (via drill 0.36)
  Top 0.406: v62.93,11.7 v65.56,4.28
  Bottom 0.406: v65.56,4.28 59.92,10.77
L141  (via drill 0.36)
  Top 0.406: v63.91,12.06 v66.73,4.71
  Bottom 0.406: v66.73,4.71 60.93,11.05
L142  (via drill 0.36)
  Top 0.406: v67.75,13.77 v71.32,6.76
  Bottom 0.406: v71.32,6.76 64.89,12.45
L143  (via drill 0.36)
  Top 0.406: v65.85,12.87 v69.06,5.67
  Bottom 0.406: v69.06,5.67 62.93,11.7
L144  (via drill 0.36)
  Top 0.406: v66.81,13.31 v70.2,6.2
  Bottom 0.406: v70.2,6.2 63.91,12.06
L145  (via drill 0.36)
  Top 0.406: v70.5,15.31 v74.61,8.6
  Bottom 0.406: v74.61,8.6 67.75,13.77
L146  (via drill 0.36)
  Top 0.406: v68.68,14.26 v72.44,7.34
  Bottom 0.406: v72.44,7.34 65.85,12.87
L147  (via drill 0.36)
  Top 0.406: v69.6,14.77 v73.53,7.96
  Bottom 0.406: v73.53,7.96 66.81,13.31
L148  (via drill 0.36)
  Top 0.406: v73.12,17.06 v77.75,10.69
  Bottom 0.406: v77.75,10.69 70.5,15.31
L149  (via drill 0.36)
  Top 0.406: v71.39,15.87 v75.68,9.27
  Bottom 0.406: v75.68,9.27 68.68,14.26
L150  (via drill 0.36)
  Top 0.406: v72.26,16.46 v76.72,9.97
  Bottom 0.406: v76.72,9.97 69.6,14.77
L151  (via drill 0.36)
  Top 0.406: v75.59,19.01 v80.71,13.03
  Bottom 0.406: v80.71,13.03 73.12,17.06
L152  (via drill 0.36)
  Top 0.406: v73.96,17.69 v78.75,11.44
  Bottom 0.406: v78.75,11.44 71.39,15.87
L153  (via drill 0.36)
  Top 0.406: v74.79,18.34 v79.74,12.22
  Bottom 0.406: v79.74,12.22 72.26,16.46
L154  (via drill 0.36)
  Top 0.406: v77.91,21.15 v83.47,15.59
  Bottom 0.406: v83.47,15.59 75.59,19.01
L155  (via drill 0.36)
  Top 0.406: v76.38,19.71 v81.65,13.86
  Bottom 0.406: v81.65,13.86 73.96,17.69
L156  (via drill 0.36)
  Top 0.406: v77.16,20.42 v82.58,14.71
  Bottom 0.406: v82.58,14.71 74.79,18.34
L157  (via drill 0.36)
  Top 0.406: v80.05,23.47 v86.03,18.35
  Bottom 0.406: v86.03,18.35 77.91,21.15
L158  (via drill 0.36)
  Top 0.406: v78.64,21.91 v84.35,16.48
  Bottom 0.406: v84.35,16.48 76.38,19.71
L159  (via drill 0.36)
  Top 0.406: v79.35,22.68 v85.2,17.41
  Bottom 0.406: v85.2,17.41 77.16,20.42
L160  (via drill 0.36)
  Top 0.406: v82,25.94 v88.37,21.31
  Bottom 0.406: v88.37,21.31 80.05,23.47
L161  (via drill 0.36)
  Top 0.406: v80.72,24.27 v86.84,19.32
  Bottom 0.406: v86.84,19.32 78.64,21.91
L162  (via drill 0.36)
  Top 0.406: v81.37,25.1 v87.62,20.31
  Bottom 0.406: v87.62,20.31 79.35,22.68
L163  (via drill 0.36)
  Top 0.406: v83.75,28.56 v90.46,24.45
  Bottom 0.406: v90.46,24.45 82,25.94
L164  (via drill 0.36)
  Top 0.406: v82.6,26.8 v89.09,22.34
  Bottom 0.406: v89.09,22.34 80.72,24.27
L165  (via drill 0.36)
  Top 0.406: v83.19,27.67 v89.79,23.38
  Bottom 0.406: v89.79,23.38 81.37,25.1
L166  (via drill 0.36)
  Top 0.406: v85.29,31.31 v92.3,27.74
  Bottom 0.406: v92.3,27.74 83.75,28.56
L167  (via drill 0.36)
  Top 0.406: v84.28,29.46 v91.1,25.53
  Bottom 0.406: v91.1,25.53 82.6,26.8
L168  (via drill 0.36)
  Top 0.406: v84.8,30.38 v91.72,26.62
  Bottom 0.406: v91.72,26.62 83.19,27.67
L169  (via drill 0.36)
  Top 0.406: v86.61,34.17 v93.88,31.16
  Bottom 0.406: v93.88,31.16 85.29,31.31
L170  (via drill 0.36)
  Top 0.406: v85.75,32.25 v92.86,28.86
  Bottom 0.406: v92.86,28.86 84.28,29.46
L171  (via drill 0.36)
  Top 0.406: v86.19,33.21 v93.39,30
  Bottom 0.406: v93.39,30 84.8,30.38
L172  (via drill 0.36)
  Top 0.406: v87.7,37.13 v95.19,34.7
  Bottom 0.406: v95.19,34.7 86.61,34.17
L173  (via drill 0.36)
  Top 0.406: v87,35.15 v94.35,32.33
  Bottom 0.406: v94.35,32.33 85.75,32.25
L174  (via drill 0.36)
  Top 0.406: v87.36,36.13 v94.78,33.51
  Bottom 0.406: v94.78,33.51 86.19,33.21
L175  (via drill 0.36)
  Top 0.406: v88.55,40.16 v96.21,38.32
  Bottom 0.406: v96.21,38.32 87.7,37.13
L176  (via drill 0.36)
  Top 0.406: v88.01,38.13 v95.56,35.9
  Bottom 0.406: v95.56,35.9 87,35.15
L177  (via drill 0.36)
  Top 0.406: v88.3,39.14 v95.9,37.11
  Bottom 0.406: v95.9,37.11 87.36,36.13
L178  (via drill 0.36)
  Top 0.406: v89.17,43.25 v96.94,42.02
  Bottom 0.406: v96.94,42.02 88.55,40.16
L179  (via drill 0.36)
  Top 0.406: v88.78,41.19 v96.49,39.55
  Bottom 0.406: v96.49,39.55 88.01,38.13
L180  (via drill 0.36)
  Top 0.406: v88.99,42.22 v96.73,40.78
  Bottom 0.406: v96.73,40.78 88.3,39.14
L182  (via drill 0.36)
  Top 0.406: v89.32,44.29 v97.12,43.26
  Bottom 0.406: v97.12,43.26 88.78,41.19
L187  (via drill 0.36)
  Top 0.406: v89.54,52.68 v97.39,53.3
  Bottom 0.406: v97.39,53.3 89.66,49.53
L188  (via drill 0.36)
  Top 0.406: v89.65,50.58 v97.52,50.79
  Bottom 0.406: v97.52,50.79 89.61,47.43
N$1
  Top 0.406: BT4.GND@1 28.96,24.38 25.4,27.94 25.4,68.58 28.58,71.75 38.73,71.75 41.91,74.93 69.6,74.93 BT3.PWR@1
N$34
  Bottom 0.406: R9.2 LED2.C
N$36
  Bottom 0.406: R11.2 LED3.C
N$38
  Bottom 0.406: R13.2 LED4.C
PB0
  Bottom 0.203: U1.1 46.05,56.84 45.72,56.52 45.72,53.98 43.81,52.07 40.64,52.07 | LED2.A 51.08,43.54 50.8,43.81 43.18,43.81 38.73,48.26 38.73,50.16
  Bottom 0.406: Q4.4 41.27,60.33 40.64,59.69 34.92,59.69 33.66,58.42 33.66,52.07 35.56,50.16 38.73,50.16 39.37,50.16 40.64,51.44 40.64,52.07 JP4.4
PB1  (via drill 0.38)
  Top 0.203: v44.2,34.29 35.56,34.29 33.02,36.83 33.02,57.79 34.29,59.05 40.01,59.05 40.64,58.42 JP4.3
  Bottom 0.203: LED3.A 51.08,34.01 50.8,34.29 v44.2,34.29
  Bottom 0.406: Q5.4 47.62,60.96 48.23,60.35 U1.3 40.95,58.73 40.64,58.42 JP4.3
PB2  (via drill 0.38)
  Top 0.203: v60.96,57.79 58.42,60.33 | 58.42,60.33 57.15,60.33 v56.52,59.69 | JP4.1 43.18,69.22 46.99,73.03 57.15,73.03 58.42,71.75 58.42,60.33
  Bottom 0.203: LED4.A 58.42,36.83 60.96,39.37 v60.96,57.79 | v56.52,59.69 54.61,59.69 53.98,60.33
  Bottom 0.406: U1.4 52.38,58.73 53.98,60.33 Q9.4
PB3  (via drill 0.38)
  Top 0.203: JP4.5 36.45,56.52 35.31,55.37 35.31,51.56 36.07,50.8 44.98,50.8 S3.1 46.28,52.88 47.5,54.1 53.34,54.1 v53.34,55.88
  Bottom 0.203: v53.34,55.88 53.34,56.39 52.83,56.9 50.88,56.9 U1.6
VCC  (via drill 0.38)
  Top 0.203: JP4.2 45.09,53.98 45.72,54.61 45.72,66.67 v49.53,70.48
  Bottom 0.203: U1.5 53.98,57.79 54.61,57.15 54.61,55.25 53.98,54.61 C1.1 | v49.53,70.48 D3.C
  Bottom 0.508: D2.C D3.C D4.C 52.07,70.48 52.7,69.85 52.7,66.67 53.34,66.04 58.42,66.04 59.05,66.67 | 59.05,66.67 59.05,69.85 58.42,70.48 55.25,70.48 TP1.TP TP2.TP TP3.TP 71.75,78.11 75.56,74.3 75.56,24.13 71.72,20.29 C2.+ 57.12,20.32 JP1.5 JP1.6 | U1.5 57.15,57.79 60.33,60.96 60.33,65.41 59.05,66.67
VCC1
  Bottom 0.406: U$5.P1 12.09,5.75 15.88,9.52 19.05,9.52 20.96,7.62 20.96,6.39 J3.2
VCCSW
  Bottom 0.508: BT4.PWR@1 27.05,74.68 22.86,70.48 22.86,26.04 31.75,17.15 35.52,17.15 J4.2 39.39,17.8 44.45,22.86 JP1.4 | JP1.4 JP1.2 | JP1.4 JP1.3 JP1.1

### Text on the board
bNames: www.pemi.technology | AtTiny10 | (Bobricius) - PeMi Technology / Factory For Materializing Dreams | OFF | +3V GND | https://www.youtube.com/bobricius / https://hackaday.io/bobricius / www.tindie.com/stores/bobricius/ / www.tindie.com/stores/kitsforkids/ | ON